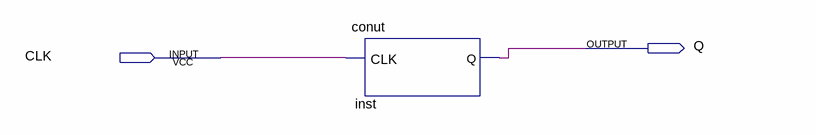
[diagram p0: schematic sheet]
// Quartus schematic testconut.bdf as structural Verilog: 1 symbols, 2 pins
module testconut (
  input  CLK,
  output Q
);

  conut inst (.CLK(CLK), .Q(Q));
endmodule
